# Altium schematic sheet MainSch.SchDoc: TestBoard (part 1 of 3)
size 292 x 193 mm; Author: Amperry - Jacopo Garau; CompanyName: Amperry; Revision: 1.1; SheetNumber: 1; SheetTotal: 3
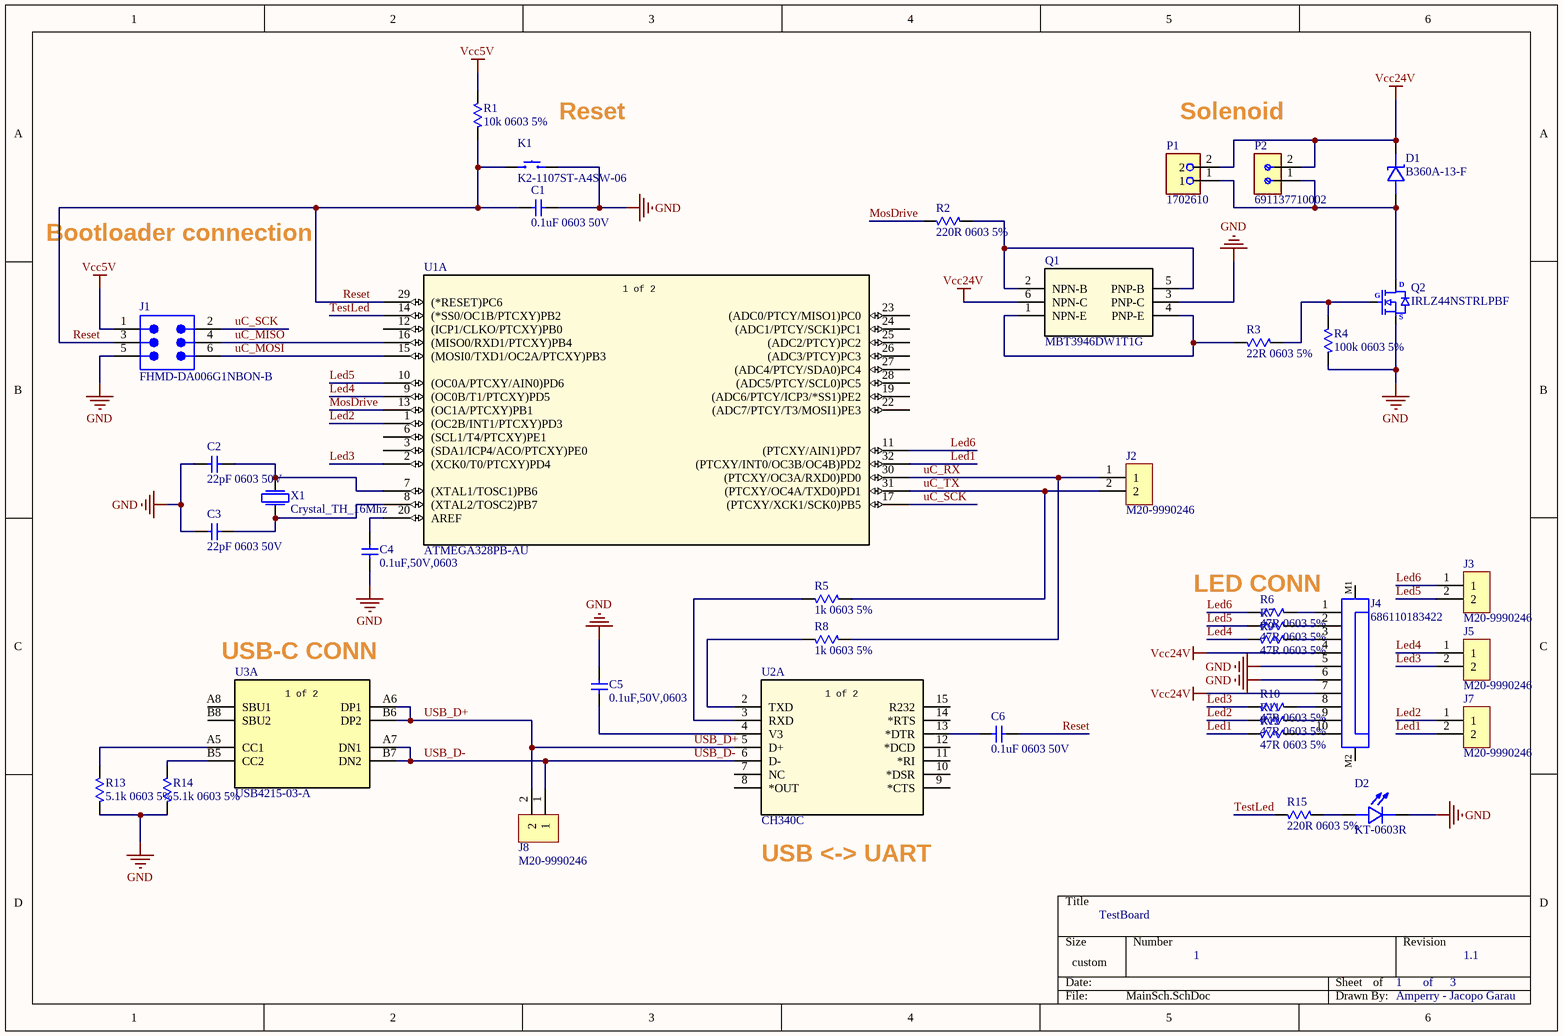
[diagram p0: MainSch.SchDoc]

## Parts
C1  0.1uF 0603 50V  [CAP_0603]
C2  22pF 0603 50V  [CAP_0603]
C3  22pF 0603 50V  [CAP_0603]
C4  0.1uF,50V,0603  [CAP_0603]
C5  0.1uF,50V,0603  [CAP_0603]
C6  0.1uF 0603 50V  [CAP_0603]
D1  B360A-13-F  [SMA-DO-214AC]
D2  KT-0603R  [LED_0603]
J1  FHMD-DA006G1NBON-B  [Header_Female_2x3_2.54mm]
J2  M20-9990246  [Header_Male_1x2_2.54mm]
J3  M20-9990246  [Header_Male_1x2_2.54mm]
J4  686110183422  [686110183422]
J5  M20-9990246  [Header_Male_1x2_2.54mm]
J7  M20-9990246  [Header_Male_1x2_2.54mm]
J8  M20-9990246  [Header_Male_1x2_2.54mm]
K1  K2-1107ST-A4SW-06  [K2-1107ST-A4SW-06]
P1  1702610  [1702610]
P2  691137710002  [Termina_Block_1x2_5mm]
Q1  MBT3946DW1T1G  [SOT-363]
Q2  IRLZ44NSTRLPBF  [D2PAK]
R1  10k 0603 5%  [RES_0603]
R2  220R 0603 5%  [RES_0603]
R3  22R 0603 5%  [RES_0603]
R4  100k 0603 5%  [RES_0603]
R5  1k 0603 5%  [RES_0603]
R6  47R 0603 5%  [RES_0603]
R7  47R 0603 5%  [RES_0603]
R8  1k 0603 5%  [RES_0603]
R9  47R 0603 5%  [RES_0603]
R10  47R 0603 5%  [RES_0603]
R11  47R 0603 5%  [RES_0603]
R12  47R 0603 5%  [RES_0603]
R13  5.1k 0603 5%  [RES_0603]
R14  5.1k 0603 5%  [RES_0603]
R15  220R 0603 5%  [RES_0603]
U1  ATMEGA328PB-AU  [TQFP-32]  (part A of 2)
U2  CH340C  [SOP-16]  (part A of 2)
U3  USB4215-03-A  [USB4215-03-A]  (part A of 2)
X1  Crystal_TH_16Mhz  [XTAL_TH_4.88mm]

## Nets
GND: C1.2 C2.1 C3.1 C4.1 C5.1 D2.K J1.5 J4.5 J4.6 K1.2 Q1.3(PNP-C) Q2.3(S) R4.1 R13.1 R14.1
Vcc5V: J1.1 R1.2
Vcc24V: D1.K J4.4 J4.7 P1.2 P2.2 Q1.6(NPN-C)
Led1: J7.2 R12.1 U1.32((PTCXY/INT0/OC3B/OC4B)PD2)
Led2: J7.1 R11.1 U1.1((OC2B/INT1/PTCXY)PD3)
Led3: J5.2 R10.1 U1.2((XCK0/T0/PTCXY)PD4)
Led4: J5.1 R9.1 U1.9((OC0B/T1/PTCXY)PD5)
Led5: J3.2 R7.1 U1.10((OC0A/PTCXY/AIN0)PD6)
Led6: J3.1 R6.1 U1.11((PTCXY/AIN1)PD7)
MosDrive: R2.1 U1.13((OC1A/PTCXY)PB1)
Reset: C1.1 C6.2 J1.3 K1.1 R1.1 U1.29((*RESET)PC6)
TestLed: R15.1 U1.14((*SS0/OC1B/PTCXY)PB2)
uC_MISO: J1.4 U1.16((MISO0/RXD1/PTCXY)PB4)
uC_MOSI: J1.6 U1.15((MOSI0/TXD1/OC2A/PTCXY)PB3)
uC_RX: J2.1 R8.2 U1.30((PTCXY/OC3A/RXD0)PD0)
uC_SCK: J1.2 U1.17((PTCXY/XCK1/SCK0)PB5)
uC_TX: J2.2 R5.2 U1.31((PTCXY/OC4A/TXD0)PD1)
USB_D+: J8.2 U2.5(D+) U3.A6(DP1) U3.B6(DP2)
USB_D-: J8.1 U2.6(D-) U3.A7(DN1) U3.B7(DN2)
NetC2_2: C2.2 U1.7((XTAL1/TOSC1)PB6) X1.2
NetC3_2: C3.2 U1.8((XTAL2/TOSC2)PB7) X1.1
NetC4_2: C4.2 U1.20(AREF)
NetC5_2: C5.2 U2.4(V3)
NetC6_1: C6.1 U2.13(*DTR)
NetD1_A: D1.A P1.1 P2.1 Q2.2(D)
NetD2_A: D2.A R15.2
NetJ4_1: J4.1 R6.2
NetJ4_2: J4.2 R7.2
NetJ4_3: J4.3 R9.2
NetJ4_8: J4.8 R10.2
NetJ4_9: J4.9 R11.2
NetJ4_10: J4.10 R12.2
NetQ1_1: Q1.1(NPN-E) Q1.4(PNP-E) R3.1
NetQ1_2: Q1.2(NPN-B) Q1.5(PNP-B) R2.2
NetQ2_1: Q2.1(G) R3.2 R4.2
NetR5_1: R5.1 U2.3(RXD)
NetR8_1: R8.1 U2.2(TXD)
NetR13_2: R13.2 U3.A5(CC1)
NetR14_2: R14.2 U3.B5(CC2)

Not connected (* = marked no-connect by the designer): J4 M1 M2; U1 3((SDA1/ICP4/ACO/PTCXY)PE0) 6((SCL1/T4/PTCXY)PE1) 12((ICP1/CLKO/PTCXY)PB0) 19((ADC6/PTCY/ICP3/*SS1)PE2) 22((ADC7/PTCY/T3/MOSI1)PE3) 23((ADC0/PTCY/MISO1)PC0) 24((ADC1/PTCY/SCK1)PC1) 25((ADC2/PTCY)PC2) 26((ADC3/PTCY)PC3) 27((ADC4/PTCY/SDA0)PC4) 28((ADC5/PTCY/SCL0)PC5); U2 7(NC) 8(*OUT) 9(*CTS) 10(*DSR) 11(*RI) 12(*DCD) 14(*RTS) 15(R232); U3 A8(SBU1) B8(SBU2)

## Notes on the sheet
- (near K1) Reset
- Solenoid
- Bootloader connection
- (near R6) LED CONN
- (near U3) USB-C CONN
- USB <-> UART
- of
- (in symbol CMP-011-00013-5) .
- (in symbol CMP-031-000005-2, part A) 1 of 2
- (in symbol CMP-036-000083-3, part A) 1 of 2
- (in symbol CMP-036-000093-2, part A) 1 of 2